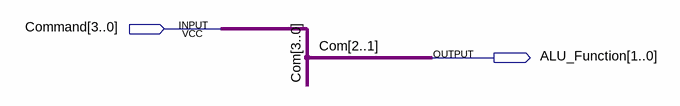
[diagram p0: schematic sheet]
// Quartus schematic SelectALUFunction.bdf as structural Verilog: 0 symbols, 2 pins
module SelectALUFunction (
  input  [3:0] Command,
  output [1:0] ALU_Function
);


  assign ALU_Function = Command[2:1];

  // Other names for the same wires on the sheet: Com[3:0] = Command
endmodule
